# Altium schematic sheet microsmt_pnpboard_v17_sheet_2.schdoc
size 518 x 325 mm
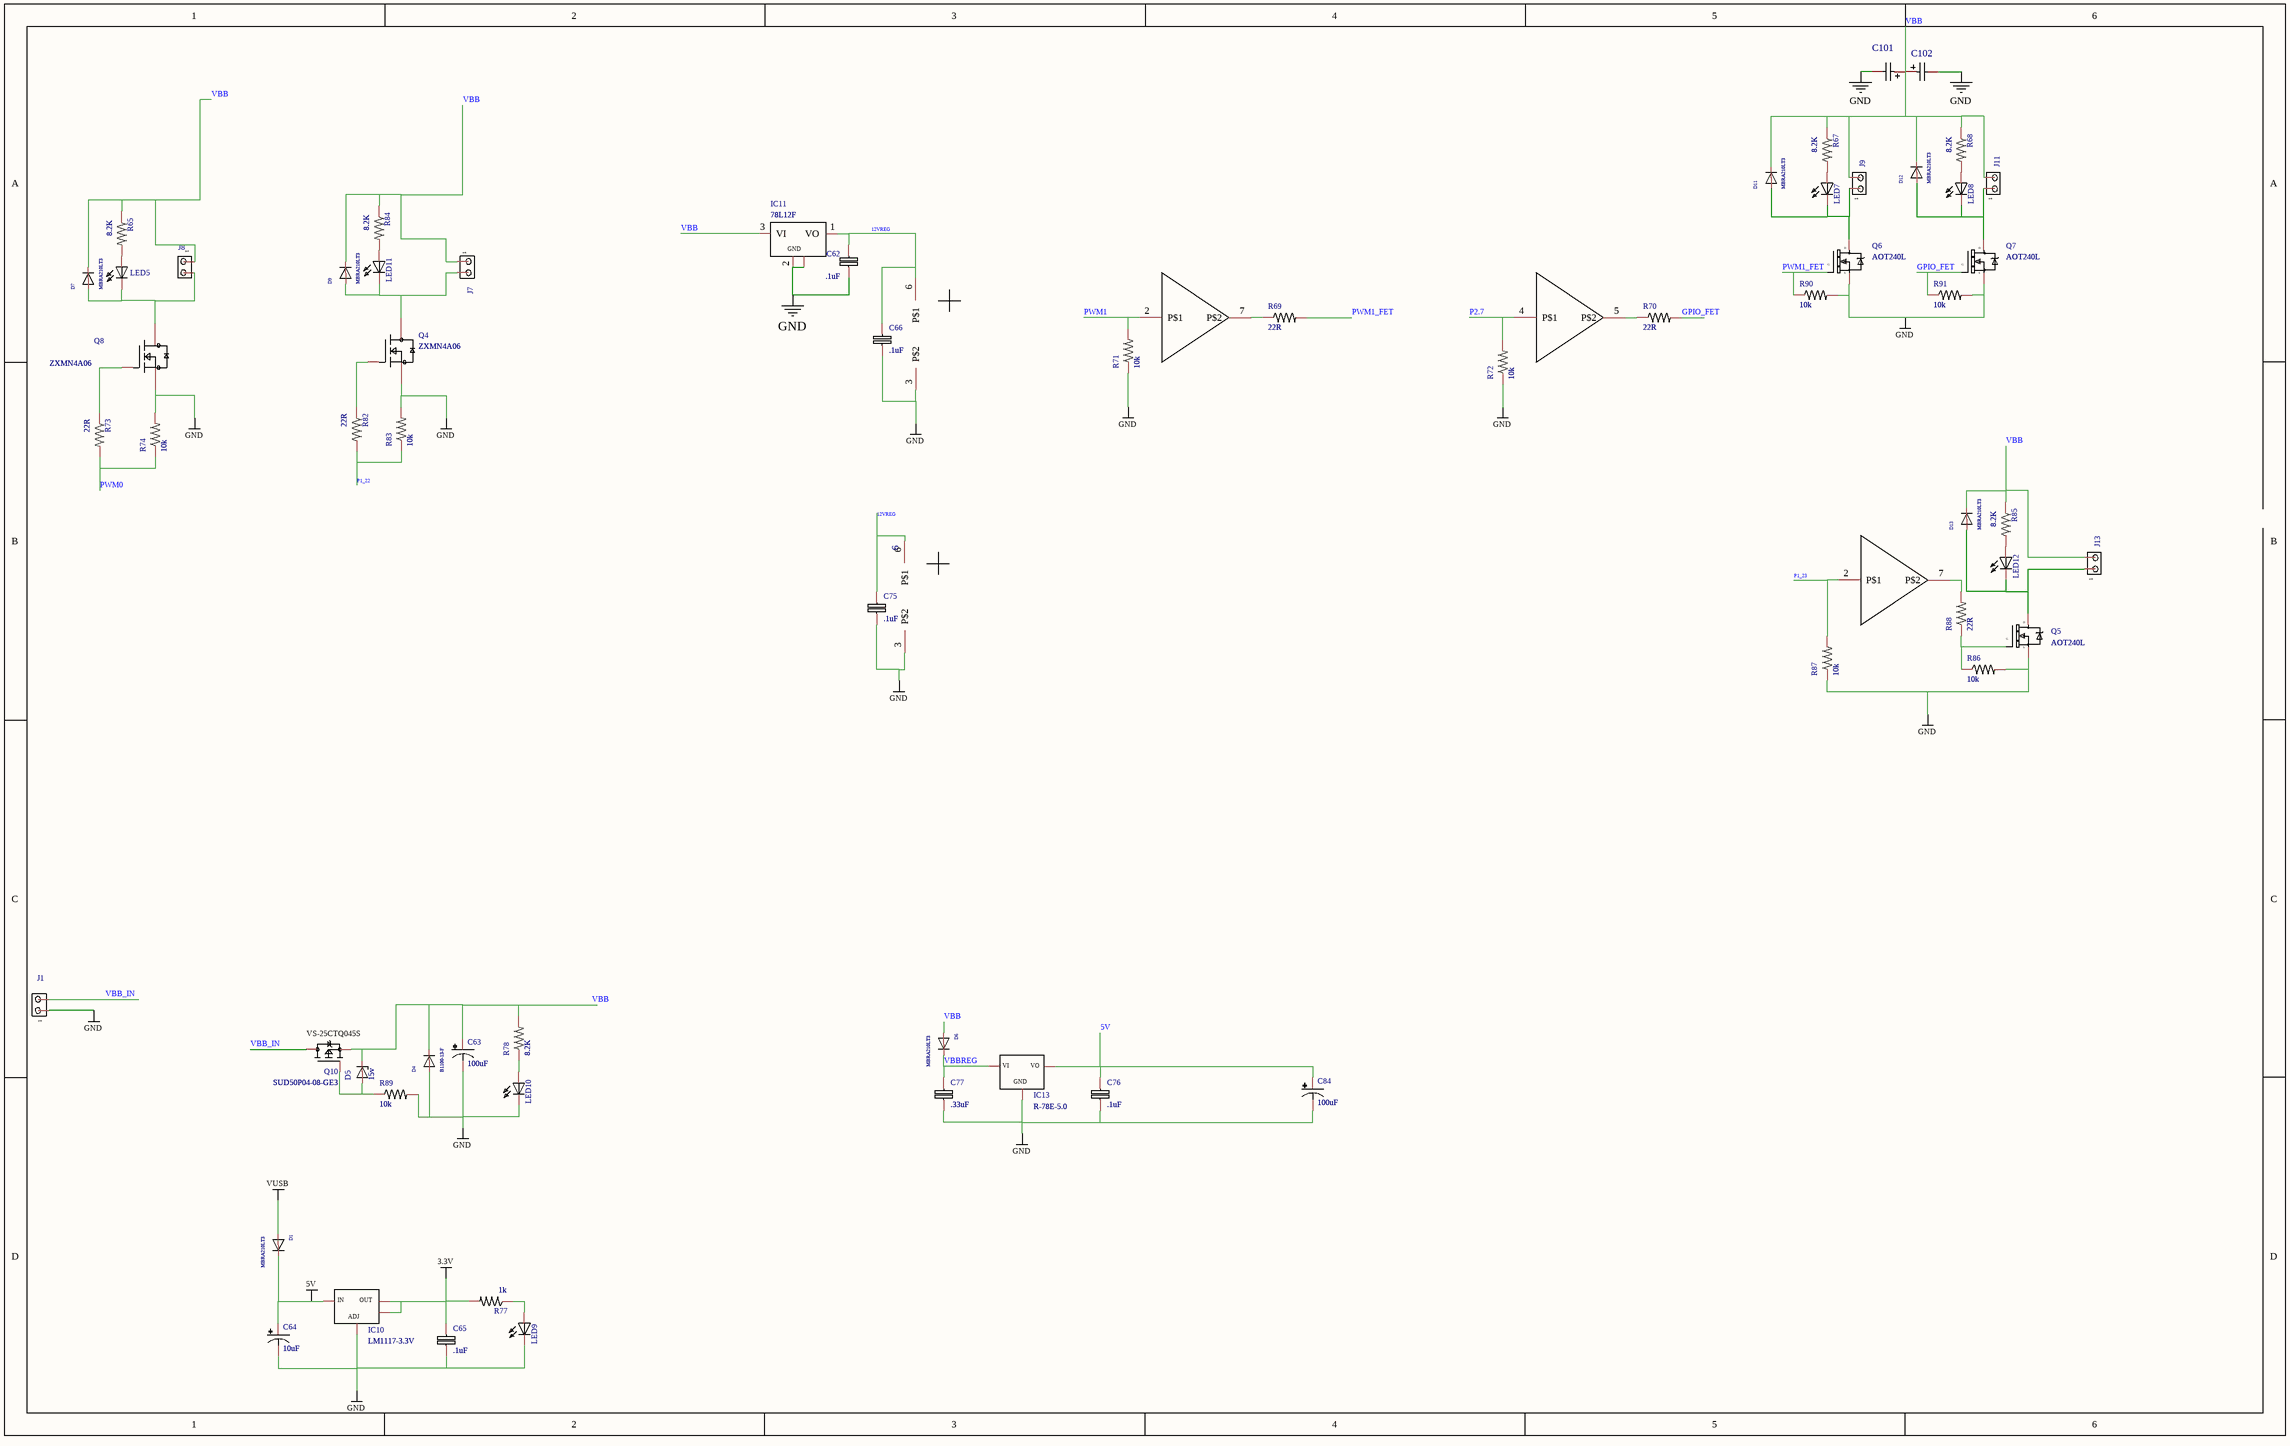
[diagram p0: microsmt_pnpboard_v17_sheet_2.schdoc]

## Parts
C62  .1uF  [R0603]
C63  100uF  [SMD8X10.5MM]
C64  10uF  [EIA3216]
C65  .1uF  [R0603]
C66  .1uF  [R0603]
C75  .1uF  [C0603]
C76  .1uF  [C0603]
C77  .33uF  [C0603]
C84  100uF  [SMD8X10.5MM]
C101  C_Ele_SMD_3x5.4mm  [贴片铝电解8*10.5]  (value not drawn)
C102  C_Ele_SMD_3x5.4mm  [贴片铝电解8*10.5]  (value not drawn)
D1  MBRA210LT3  [SMADIODE]
D4  B1100-13-F  [SMADIODE]
D5  15v  [SMB_L4.4-W3.6-LS5.3-RD]
D6  MBRA210LT3  [SMADIODE]
D7  MBRA210LT3  [SMADIODE]
D9  MBRA210LT3  [SMADIODE]
D11  MBRA210LT3  [SMADIODE]
D12  MBRA210LT3  [SMADIODE]
D13  MBRA210LT3  [SMADIODE]
IC10  LM1117-3.3V  [PG-SOT223-4_L6.5-W3.5-P2.30-LS7.0-BR]
IC11  78L12F  [SOT-89-3_L4.5-W2.5-P1.50-LS4.2-TL]
IC13  R-78E-5.0  [PWRM-TH_R-78E3.3-0.5]
IC14  TC4427  [SOIC8-1.27-5X4MM]  (value not drawn)  (parts A,B,C of 3)
IC15  TC4427  [SOIC8-1.27-5X4MM]  (value not drawn)  (parts A,B of 2)
J1  MTA02-100  [CONN-TH_P7.62_KF7620-7.62-2P]  (value not drawn)
J7  MTA02-100  [180G-2]  (value not drawn)
J8  MTA02-100  [180G-2]  (value not drawn)
J9  MTA02-100  [KF2EDG5.08-2P]  (value not drawn)
J11  MTA02-100  [KF2EDG5.08-2P]  (value not drawn)
J13  MTA02-100  [KF2EDG5.08-2P]  (value not drawn)
LED5  LEDCHIP-LED0805  [LED0805-RD]  (value not drawn)
LED7  LEDCHIP-LED0805  [LED0805-RD]  (value not drawn)
LED8  LEDCHIP-LED0805  [LED0805-RD]  (value not drawn)
LED9  LEDCHIP-LED0805  [LED0805-RD]  (value not drawn)
LED10  LEDCHIP-LED0805  [LED0805-RD]  (value not drawn)
LED11  LEDCHIP-LED0805  [LED0805-RD]  (value not drawn)
LED12  LEDCHIP-LED0805  [LED0805-RD]  (value not drawn)
Q4  ZXMN4A06  [SOT230P700X160-4N]
Q5  AOT240L  [TO220BV]
Q6  AOT240L  [TO220BV]
Q7  AOT240L  [TO220BV]
Q8  ZXMN4A06  [SOT230P700X160-4N]
Q10  SUD50P04-08-GE3  [PG-TO252-3_L6.6-W6.0-P4.56-LS10.0-BR-CW]
R65  8.2K  [R0603]
R67  8.2K  [R0603]
R68  8.2K  [R0603]
R69  22R  [R0603]
R70  22R  [R0603]
R71  10k  [R0603]
R72  10k  [R0603]
R73  22R  [R0603]
R74  10k  [R0603]
R77  1k  [R0603]
R78  8.2K  [R0603]
R82  22R  [R0603]
R83  10k  [R0603]
R84  8.2K  [R0603]
R85  8.2K  [R0603]
R86  10k  [R0603]
R87  10k  [R0603]
R88  22R  [R0603]
R89  10k  [R0603]
R90  10k  [R0603]
R91  10k  [R0603]

## Nets
3.3V: C65.1 IC10.2(OUT) IC10.4(OUT) R77.2
5V: C64.A(+) C76.1 C84.1 D1.C IC10.3(IN) IC13.3(VO)
GND: C62.2 C63.2 C64.C(-) C65.2 C66.2 C75.2 C76.2 C77.2 C84.2 C101.2 C102.2 D4.A IC10.1(ADJ) IC11.2(GND) IC13.2(GND) IC14.3(P$2) IC15.3(P$2) J1.1 LED9.1 LED10.1 Q4.3(S) Q5.S Q6.S Q7.S Q8.3(S) R71.1 R72.1 R74.2 R83.2 R86.2 R87.1 R89.2 R90.2 R91.2
VUSB: D1.A
12VREG: C62.1 C66.1 C75.1 IC11.1(VO) IC14.6(P$1) IC15.6(P$1)
GPIO_FET: Q7.G R70.2 R91.1
P1_22: R82.2 R83.1
P1_23: IC15.2(P$1) R87.2
P2.7: IC14.4(P$1) R72.2
PWM0: R73.2 R74.1
PWM1: IC14.2(P$1) R71.2
PWM1_FET: Q6.G R69.2 R90.1
VBB: C63.1 C101.1 C102.1 D4.C D5.1 D6.A D7.C D9.C D11.C D12.C D13.C IC11.3(VI) J7.1 J8.1 J9.2 J11.2 J13.2 Q10.2(S) R65.1 R67.1 R68.1 R78.2 R84.1 R85.1
VBB_IN: J1.2 Q10.3(D)
VBBREG: C77.1 D6.C IC13.1(VI)
NetD5_2: D5.2 Q10.1(G) R89.1
NetD7_A: D7.A J8.2 LED5.1 Q8.4(D)
NetD9_A: D9.A J7.2 LED11.1 Q4.4(D)
NetD11_A: D11.A J9.1 LED7.1 Q6.D
NetD12_A: D12.A J11.1 LED8.1 Q7.D
NetD13_A: D13.A J13.1 LED12.1 Q5.D
NetIC14_5: IC14.5(P$2) R70.1
NetIC14_7: IC14.7(P$2) R69.1
NetIC15_7: IC15.7(P$2) R88.2
NetLED5_2: LED5.2 R65.2
NetLED7_2: LED7.2 R67.2
NetLED8_2: LED8.2 R68.2
NetLED9_2: LED9.2 R77.1
NetLED10_2: LED10.2 R78.1
NetLED11_2: LED11.2 R84.2
NetLED12_2: LED12.2 R85.2
NetQ4_1: Q4.1(G) R82.1
NetQ5_G: Q5.G R86.1 R88.1
NetQ8_1: Q8.1(G) R73.1

## Notes on the sheet
- (near Q10) VS-25CTQ045S

## Library data of the parts
C62 C65 C66 C75 C76 = .1uF: Convert to PCB: yes; Name: .1uF; Symbol: .1uF; Device: .1uF; Add into BOM: yes
  C62 C65 C66: Origin Footprint: R0603
  C75 C76: Origin Footprint: C0603
C63 C84 = 100uF: Convert to PCB: yes; Name: 100uF; Symbol: 100uF; Device: 100uF; Add into BOM: yes; Origin Footprint: SMD8X10.5MM
C64 = 10uF: Convert to PCB: yes; Name: 10uF; Symbol: 10uF; Device: 10uF; Add into BOM: yes; Origin Footprint: EIA3216
C77 = .33uF: Convert to PCB: yes; Name: .33uF; Symbol: .33uF; Device: .33uF; Add into BOM: yes; Origin Footprint: C0603
C101 C102 = C_Ele_SMD_3x5.4mm: 容值:10uF;精度:±20%;额定电压:16V;电容体直径:-;电容体长度:-;纹波电流:-;等效串联电阻:-;工作寿命:2000hrs@85;工作温度:-40~+85;; Name: 10uF; Symbol: CAP; Add into BOM: yes; Value: 10uF; NUMBER: 2; Pin Type: IN; Device: C_Ele_SMD_3x5.4mm; Supplier Footprint: SMD,3x5.4mm; Convert to PCB: yes
D1 D6 D7 D9 D11-D13 = MBRA210LT3: Convert to PCB: yes; Name: MBRA210LT3; Symbol: MBRA210LT3; Device: MBRA210LT3; Add into BOM: yes; Origin Footprint: SMADIODE
D4 = B1100-13-F: Convert to PCB: yes; Name: B1100-13-F; Symbol: B1100-13-F; Device: B1100-13-F; Add into BOM: yes; Origin Footprint: SMADIODE
D5 = 15v: Convert to PCB: yes; Name: 15v; Symbol: 15v; Device: 15v; Add into BOM: yes; Origin Footprint: SMB_L4.4-W3.6-LS5.3-RD
IC10 = LM1117-3.3V: Convert to PCB: yes; Name: LM1117-3.3V; Symbol: LM1117-3.3V; Device: LM1117-3.3V; Add into BOM: yes; Origin Footprint: PG-SOT223-4_L6.5-W3.5-P2.30-LS7.0-BR
IC11 = 78L12F: Convert to PCB: yes; Name: 78L12F; Symbol: 78L12F; Device: 78L12F; Add into BOM: yes; Origin Footprint: SOT-89-3_L4.5-W2.5-P1.50-LS4.2-TL
IC13 = R-78E-5.0: Convert to PCB: yes; Name: R-78E-5.0; Symbol: R-78E-5.0; Device: R-78E-5.0; Add into BOM: yes; Origin Footprint: PWRM-TH_R-78E3.3-0.5
IC14 IC15 = TC4427: Convert to PCB: yes; Name: TC4427; Symbol: TC4427; Device: TC4427; Add into BOM: yes; Origin Footprint: SOIC8-1.27-5X4MM
J1 J7-J9 J11 J13 = MTA02-100: Convert to PCB: yes; Name: MTA02-100; Symbol: MTA02-100; Device: MTA02-100; Add into BOM: yes
  J1: Origin Footprint: CONN-TH_P7.62_KF7620-7.62-2P
  J7 J8: Origin Footprint: 180G-2
  J9 J11 J13: Origin Footprint: KF2EDG5.08-2P
LED5 LED7-LED12 = LEDCHIP-LED0805: Convert to PCB: yes; Name: LEDCHIP-LED0805; Symbol: LEDCHIP-LED0805; Device: LEDCHIP-LED0805; Add into BOM: yes; Origin Footprint: LED0805-RD
Q4 Q8 = ZXMN4A06: Convert to PCB: yes; Name: ZXMN4A06; Symbol: ZXMN4A06; Device: ZXMN4A06; Add into BOM: yes; Origin Footprint: SOT230P700X160-4N
Q5-Q7 = AOT240L: Convert to PCB: yes; Name: AOT240L; Symbol: AOT240L; Device: AOT240L; Add into BOM: yes; Origin Footprint: TO220BV
Q10 = SUD50P04-08-GE3: Convert to PCB: yes; Name: SUD50P04-08-GE3; Symbol: SUD50P04-08-GE3; Device: SUD50P04-08-GE3; Add into BOM: yes; Origin Footprint: PG-TO252-3_L6.6-W6.0-P4.56-LS10.0-BR-CW
R65 R67 R68 R78 R84 R85 = 8.2K: Convert to PCB: yes; Name: 8.2K; Symbol: 8.2K; Device: 8.2K; Add into BOM: yes; Origin Footprint: R0603
R69 R70 R73 R82 R88 = 22R: Convert to PCB: yes; Name: 22R; Symbol: 22R; Device: 22R; Add into BOM: yes; Origin Footprint: R0603
R71 R72 R74 R83 R86 R87 R89-R91 = 10k: Convert to PCB: yes; Name: 10k; Symbol: 10k; Device: 10k; Add into BOM: yes; Origin Footprint: R0603
R77 = 1k: Convert to PCB: yes; Name: 1k; Symbol: 1k; Device: 1k; Add into BOM: yes; Origin Footprint: R0603